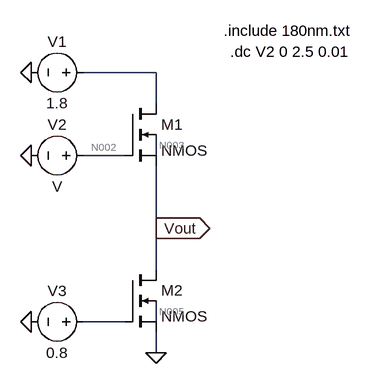
[diagram p0: schematic Draft7.asc]
Draft7.asc, the LTspice schematic file:
Version 4
SHEET 1 880 680
WIRE 208 -80 96 -80
WIRE 208 -32 208 -80
WIRE 160 48 96 48
WIRE 208 48 208 16
WIRE 208 160 208 64
WIRE 208 224 208 160
WIRE 160 304 96 304
WIRE 208 304 208 272
WIRE 208 352 208 320
FLAG 208 352 0
FLAG 208 160 Vout
IOPIN 208 160 Out
FLAG 16 -80 0
FLAG 16 48 0
FLAG 16 304 0
SYMBOL nmos4 160 -32 R0
SYMATTR InstName M1
SYMATTR Value2 l=.18u w=20u
SYMBOL nmos4 160 224 R0
SYMATTR InstName M2
SYMATTR Value2 l=.18u w=10u
SYMBOL voltage 112 -80 R90
WINDOW 0 -32 56 VBottom 2
WINDOW 3 32 56 VTop 2
WINDOW 123 0 0 Left 2
WINDOW 39 0 0 Left 2
SYMATTR InstName V1
SYMATTR Value 1.8
SYMBOL voltage 112 48 R90
WINDOW 0 -32 56 VBottom 2
WINDOW 3 32 56 VTop 2
SYMATTR InstName V2
SYMBOL voltage 112 304 R90
WINDOW 0 -32 56 VBottom 2
WINDOW 3 32 56 VTop 2
WINDOW 123 0 0 Left 2
WINDOW 39 0 0 Left 2
SYMATTR InstName V3
SYMATTR Value 0.8
TEXT 312 -144 Left 2 !.include 180nm.txt
TEXT 322 -112 Left 2 !.dc V2 0 2.5 0.01

The netlist it stands for:
* Draft7.asc
M1 N001 N002 Vout N003 NMOS l=.18u w=20u
M2 Vout N004 0 N005 NMOS l=.18u w=10u
V1 N001 0 1.8
V2 N002 0 V
V3 N004 0 0.8
.model NMOS NMOS
.model PMOS PMOS
.lib standard.mos
.include 180nm.txt
.dc V2 0 2.5 0.01
.backanno
.end

* Results of the author's LTspice run, read from the files saved beside the schematic
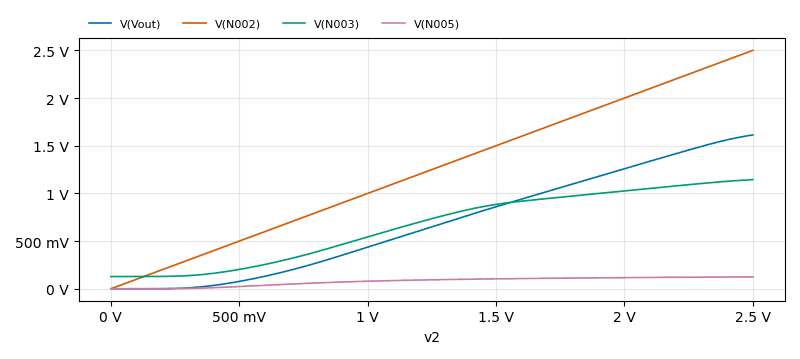
[diagram p1: DC transfer characteristic of Draft7.asc, plotted from the saved traces]
* DC transfer characteristic, 1 run:
*   V(Vout): 4.654 µV at v2=0 V, 1.614 V at v2=2.5 V, min 4.654 µV, max 1.614 V
*   V(N002): 0 V at v2=0 V, 2.5 V at v2=2.5 V, min 0 V, max 2.5 V
*   V(N003): 128.4 mV at v2=0 V, 1.145 V at v2=2.5 V, min 128.4 mV, max 1.145 V
*   V(N005): 1.71 µV at v2=0 V, 125.1 mV at v2=2.5 V, min 1.71 µV, max 125.1 mV